# Altium schematic sheet wenya.SchDoc
size A
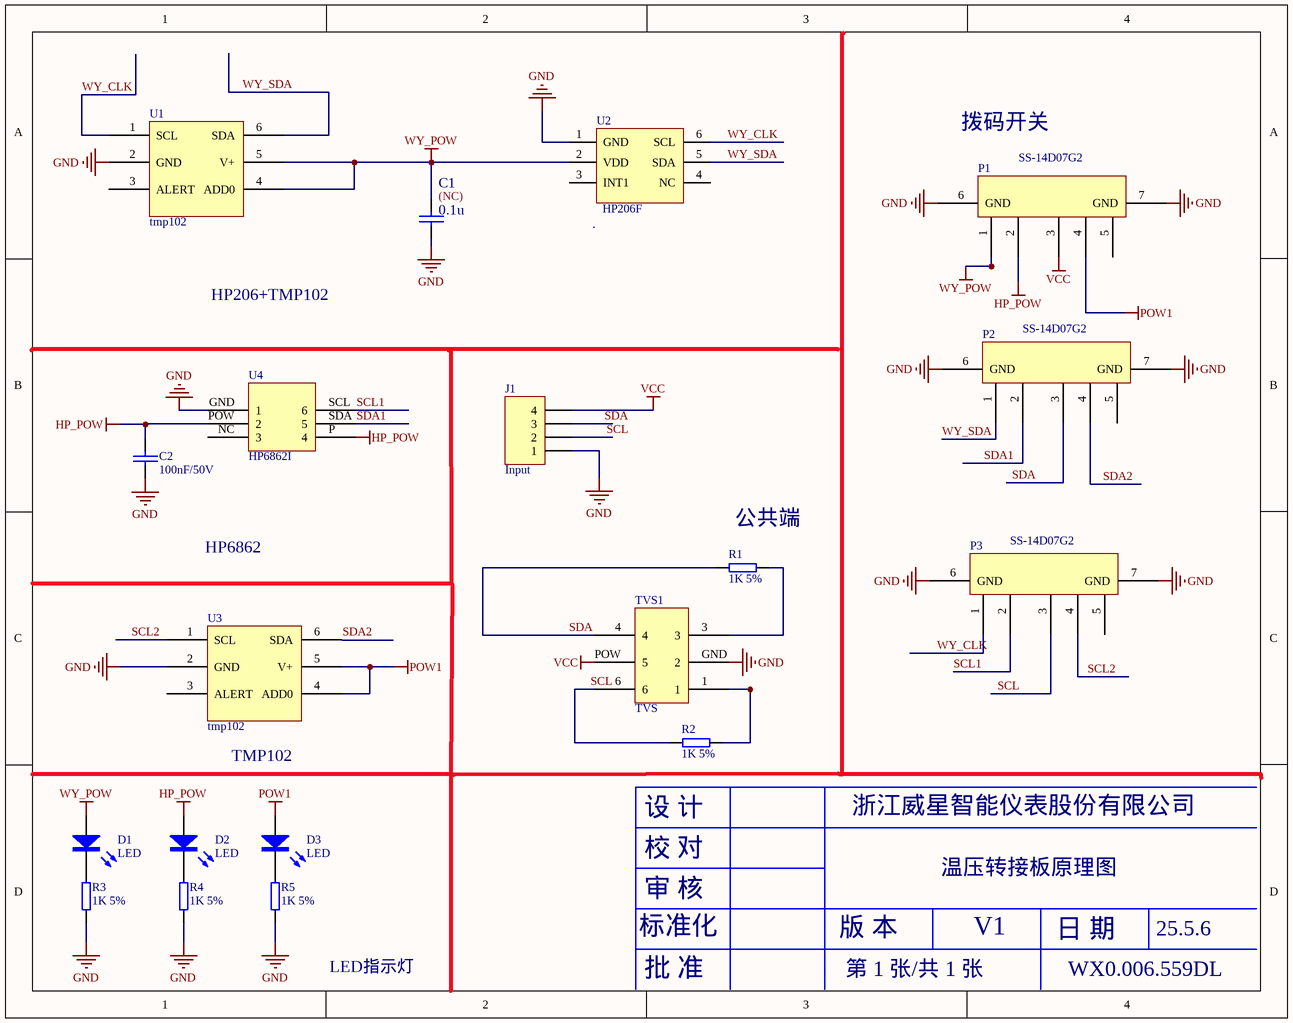
[diagram p0: wenya.SchDoc]

## Parts
C1  0.1u  [C0603]
C2  100nF/50V  [CAP0603]
D1  LED  [LED2_300]
D2  LED  [LED2_300]
D3  LED  [LED2_300]
J1  Input  [HDR1X4]
P1  SS-14D07G2  [PCBComponent_1 - duplicate]
P2  SS-14D07G2  [PCBComponent_1 - duplicate]
P3  SS-14D07G2  [PCBComponent_1 - duplicate]
R1  1K 5%  [RES0603]
R2  1K 5%  [RES0603]
R3  1K 5%  [RES0603]
R4  1K 5%  [RES0603]
R5  1K 5%  [RES0603]
TVS1  TVS  [ESD]
U1  tmp102  [SO-P6]
U2  .  [HP206C]
U3  tmp102  [SO-P6]
U4  HP6862I  [huapu]

## Nets
GND: C1.2 C2.1 J1.1 P1.6(GND) P1.7(GND) P2.6(GND) P2.7(GND) P3.6(GND) P3.7(GND) R3.2 R4.2 R5.2 TVS1.GND(2) U1.2(GND) U2.1(GND) U3.2(GND) U4.GND(1)
HP_POW: C2.2 D2.1 P1.2 U4.P(4) U4.POW(2)
POW1: D3.1 P1.4 U3.4(ADD0) U3.5(V+)
VCC: J1.4 P1.3 TVS1.POW(5)
WY_POW: C1.1 D1.1 P1.1 U1.4(ADD0) U1.5(V+) U2.2(VDD)
SCL: J1.2 P3.3 R2.2 TVS1.6
SCL1: P3.2 U4.SCL(6)
SCL2: P3.4 U3.1(SCL)
SDA: J1.3 P2.3 R1.2 TVS1.4
SDA1: P2.2 U4.SDA(5)
SDA2: P2.4 U3.6(SDA)
WY_CLK: P3.1 U1.1(SCL) U2.6(SCL)
WY_SDA: P2.1 U1.6(SDA) U2.5(SDA)
NetD1_2: D1.2 R3.1
NetD2_2: D2.2 R4.1
NetD3_2: D3.2 R5.1
NetR1_1: R1.1 TVS1.3
NetR2_1: R2.1 TVS1.1

Not connected (* = marked no-connect by the designer): P1 5; P2 5; P3 5; U1 3(ALERT); U2 3(INT1) 4(NC); U3 3(ALERT); U4 NC(3)

## Notes on the sheet
- 拨码开关
- (near C1) (NC)
- (near U2) HP206F
- HP206+TMP102
- HP6862
- (near R1) 公共端
- TMP102
- (near R2) 设 计
- 浙江威星智能仪表股份有限公司
- 审 核
- 校 对
- 温压转接板原理图
- LED指示灯
- 标准化
- 版 本
- 第 1 张/共 1 张
- V1
- 日 期
- WX0.006.559DL
- 25.5.6
- 批 准

## Library data of the parts
C1 = CAP: Capacitor
C2 = 101020103-0021: 104pF,50 V,±10%,0603,国巨,CC0603KRX7R9BB104; Part Name: 0603贴片电容; ID: 3; SMD/DIP: SMD; Part Number: 101020103-0021
D1-D3 = 101040102-0001: 圆形插件,3mm 圆形,插件,红光,湖北匡通电子有限公司,3BB4HC; Part Name: 发光二极管; ID: 6; SMD/DIP: DIP; Part Number: 101040102-0001
J1 = Header 4: Header, 4-Pin
R1-R5 = 101010103-0008: 1K,±5%,1/10W,0603,国巨,RC0603JR-071KL; Part Name: 0603贴片电阻; ID: 10; SMD/DIP: SMD; Part Number: 101010103-0008
TVS1 = TVS: pin to pad: GND>2 POW>5
U1 U3 = tem102
U2 = HP206C
U4 = HP6862I: pin to pad: GND>1 NC>3 P>4 POW>2 SCL>6 SDA>5